# Altium schematic sheet deel1.SchDoc
size A4; SheetNumber: 1; SheetTotal: 4
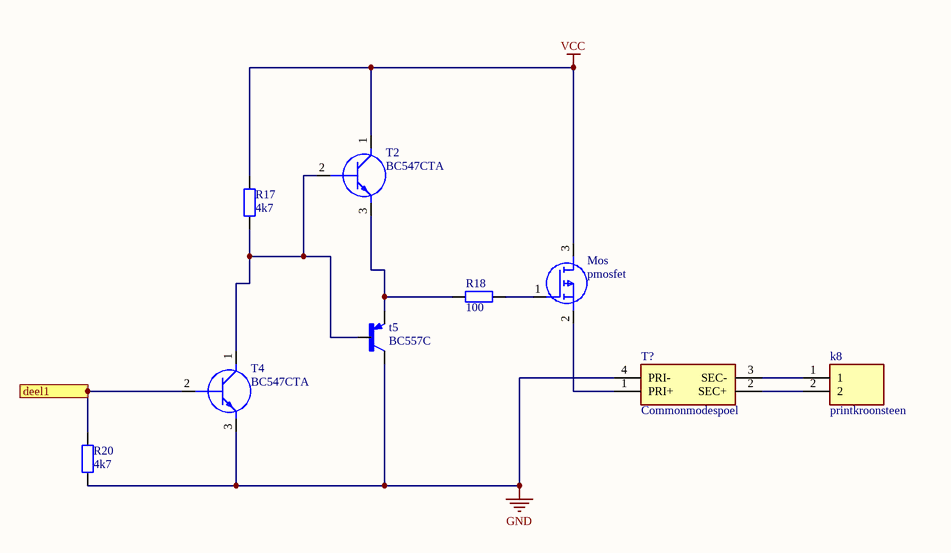
[diagram p0: deel1.SchDoc]

## Parts
k8  printkroonsteen  [printkroonsteen]
Mos  pmosfet  [pmosfet]
R17  4k7  [0805]
R18  100  [0805]
R20  4k7  [0805]
T2  BC547CTA  [bc447]
T4  BC547CTA  [bc447]
t5  BC557C  [bc557c]
T?  Commonmodespoel  [commonmodespoel]

## Ports
deel1

## Nets
GND: R20.1 T4.3(E) t5.1(C) T?.4(PRI-)
VCC: Mos.3(D) R17.2 T2.1(C)
deel1: R20.2 T4.2(B) ; port deel1
Netk8_1: k8.1 T?.3(SEC-)
Netk8_2: k8.2 T?.2(SEC+)
NetMos_1: Mos.1(G) R18.2
NetMos_2: Mos.2(S) T?.1(PRI+)
NetR17_1: R17.1 T2.2(B) T4.1(C) t5.2(B)
NetR18_1: R18.1 T2.3(E) t5.3(E)

## Library data of the parts
k8 = printkroonsteen: Connector; Manufacturer_Name: CUI Inc.; Manufacturer_Part_Number: TB007-508-02BE; Datasheet Link: https://componentsearchengine.com//TB007-508-02BE.pdf; Height: 14mm; Mouser2 Part Number: 490-TB007-508-02BE; Mouser2 Price/Stock: https://www.mouser.com/Search/Refine.aspx?Keyword=490-TB007-508-02BE
Mos = pmosfet: MOSFET (P-Channel); Manufacturer_Name: Infineon; Manufacturer_Part_Number: IRF9Z34NPBF; Datasheet Link: https://componentsearchengine.com//IRF9Z34NPBF.pdf; Height: 4.69mm; Mouser2 Part Number: 942-IRF9Z34NPBF; Mouser2 Price/Stock: https://www.mouser.com/Search/Refine.aspx?Keyword=942-IRF9Z34NPBF
R17 R18 R20 = weerstand0805: WRIS-PSMB SMT Metal Plate Resistor, size 0805, 5mOhm, 0.5W; Manufacturer: Wurth Elektronik; Manufacturer Part Number: 580060720003; Rated Current: 10A; Temperature Coefficient of Resistance: +/-100ppm/degC; Technical Reference: MB0805R005F102KAATP0000; Resistance Tolerance: +/-1%; ComponentLink1Description: Manufacturer; ComponentLink1URL: http://www.we-online.de; ComponentLink2Description: Datasheet; ComponentLink2URL: https://www.we-online.com/catalog/datasheet/580060720003.pdf; Rated Power: 0.5W; Resistance: 5mOhm; Mounting Technology: SMT; Height: 0.35mm; Packaging: Tape and Reel; Published Date: May 2020; Size: 0805; Length: 2mm; Operating Temperature: -55 to +155degC; Width: 1.25mm
T2 T4 = BC547CTA: Transistor BJT NPN; Manufacturer_Name: ON Semiconductor; Datasheet Link: http://www.onsemi.com/pub/Collateral/BC550-D.pdf; Manufacturer_Part_Number: BC547CTA
t5 = BC557C: Bipolar (BJT) Transistor PNP 30V 100mA 150MHz 500mW Through Hole TO-92-3; MP: BC557CZL1G; Package: None; Price: None; Value: *; Availability: Unavailable
T? = Commonmodespoel: Transformer; Manufacturer_Name: Laird Technologies; Manufacturer_Part_Number: CM2545X171B-10; Datasheet Link: https://datasheet.datasheetarchive.com/originals/dk/DKDS-7/122753.pdf; Height: 9.5mm